# EAGLE design BirdHouseSchem (EAGLE 9.6.2)
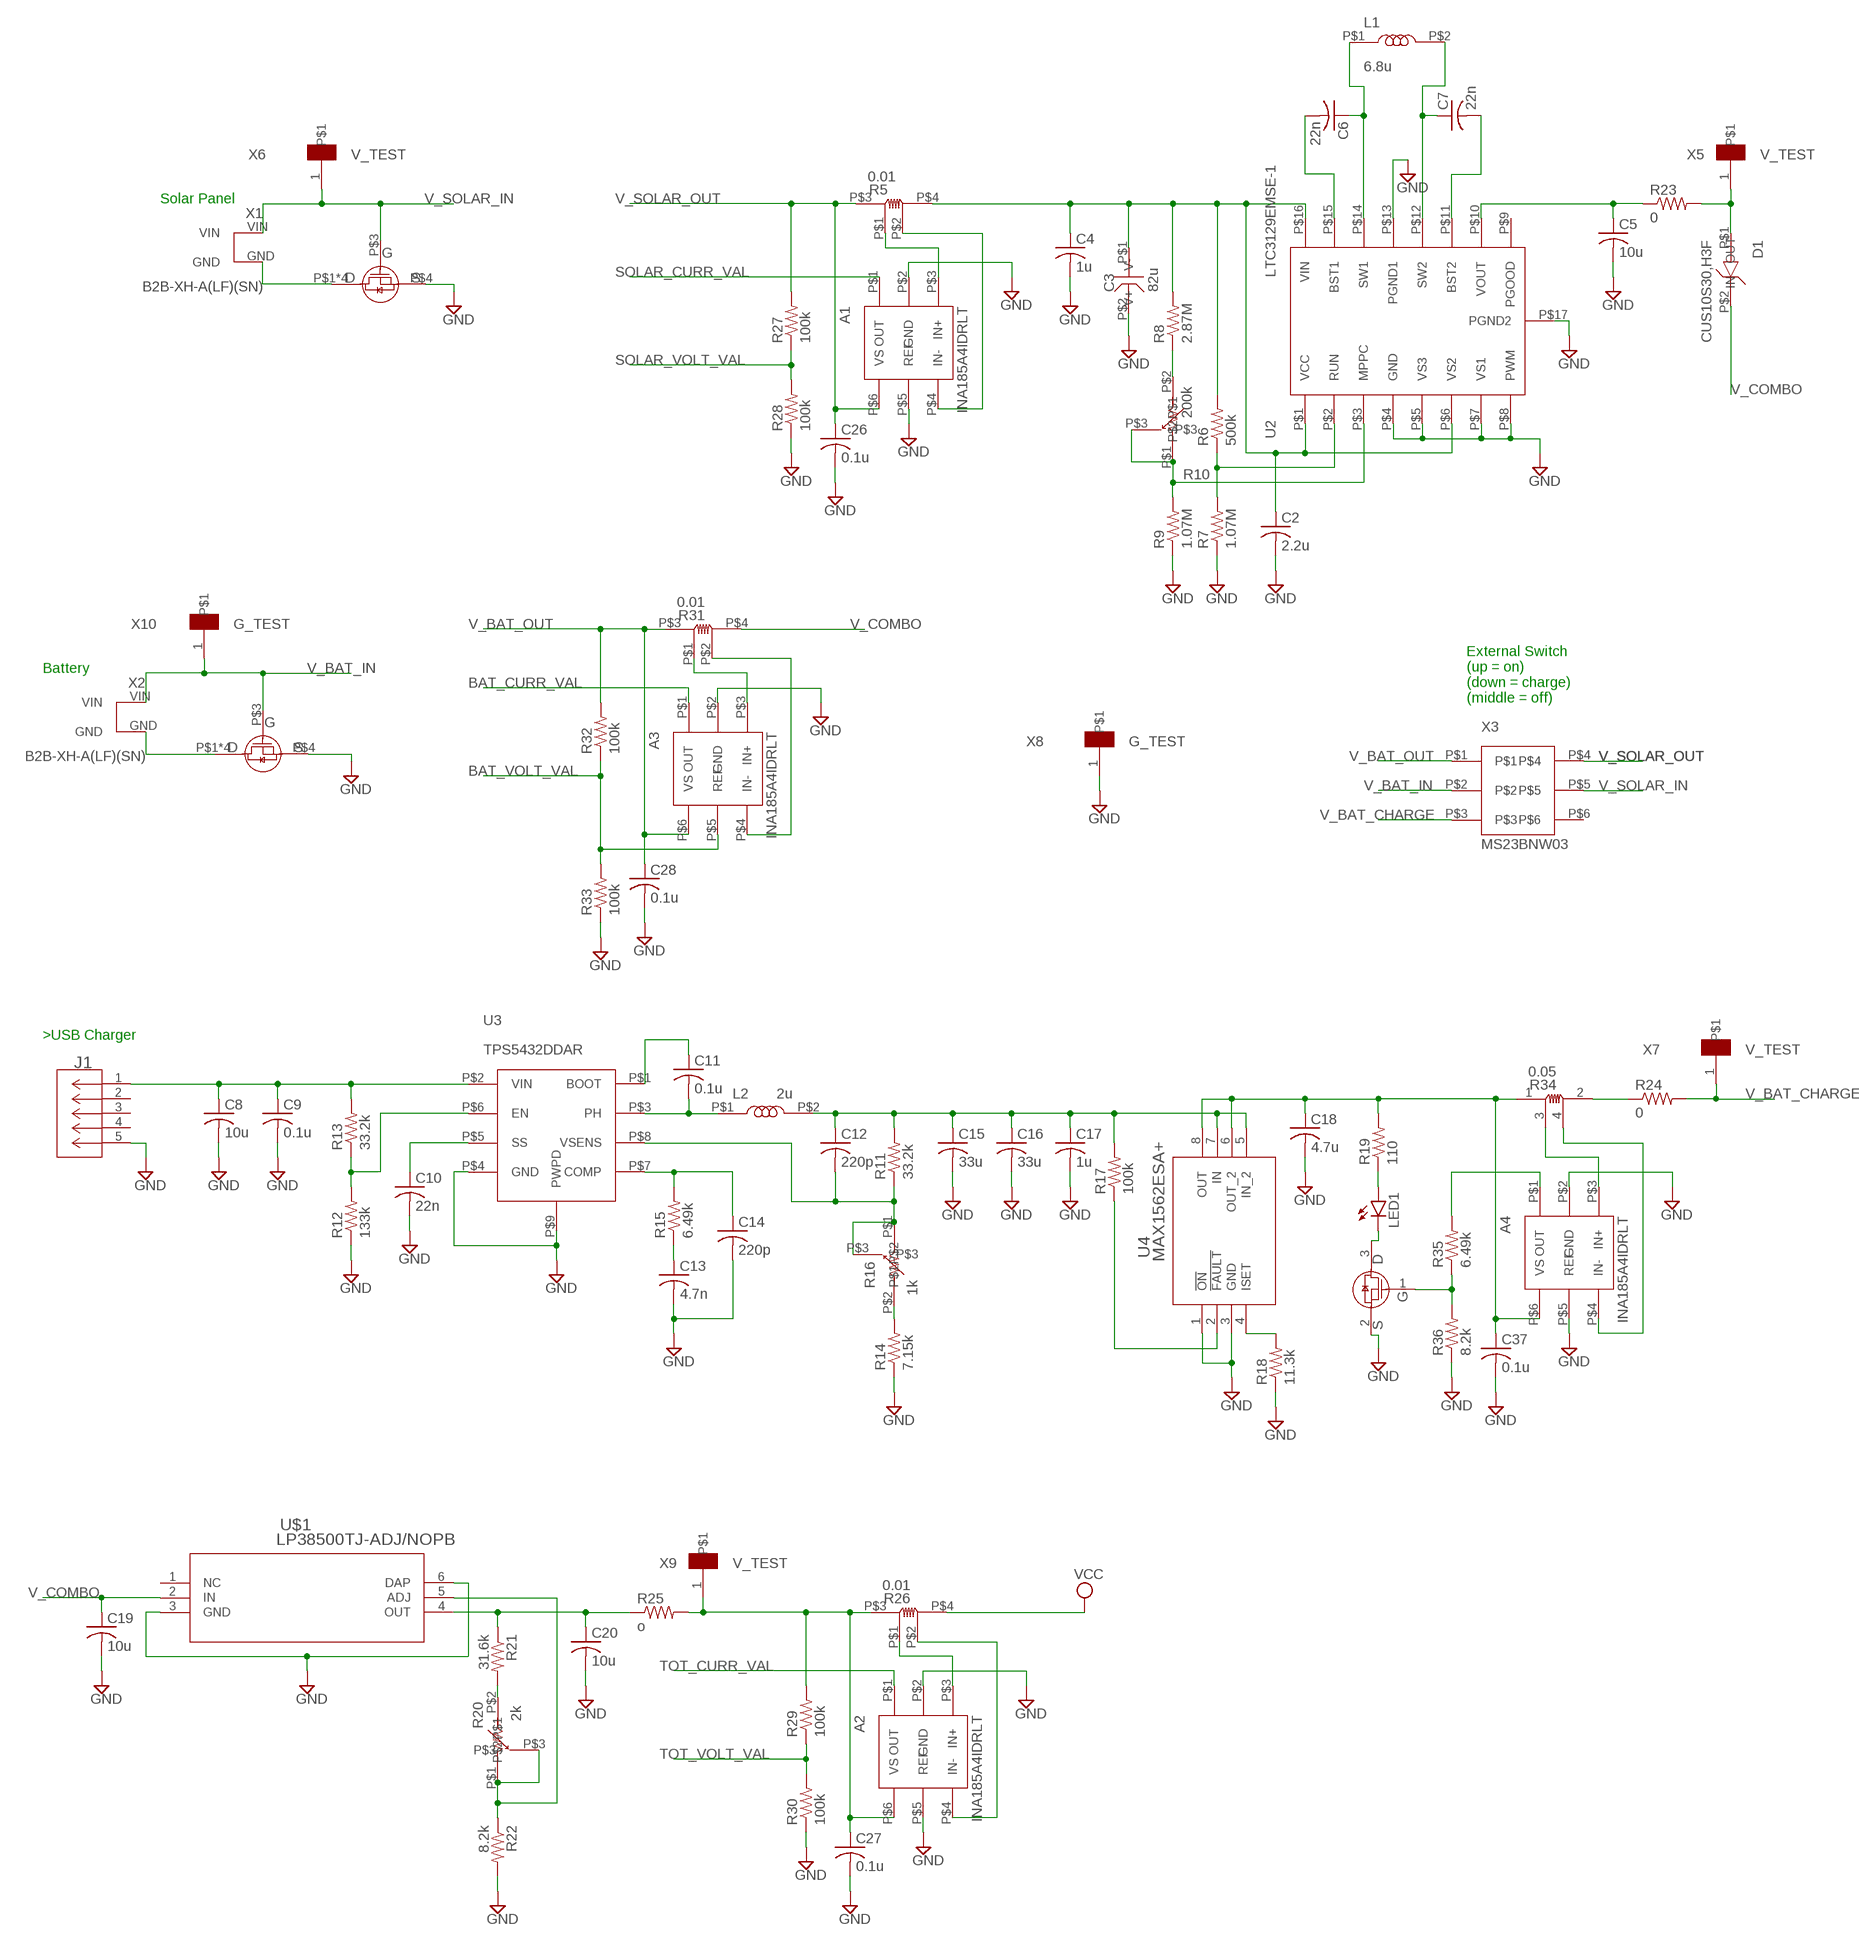
[diagram p0: schematic, sheet 1, part 1 of 2]
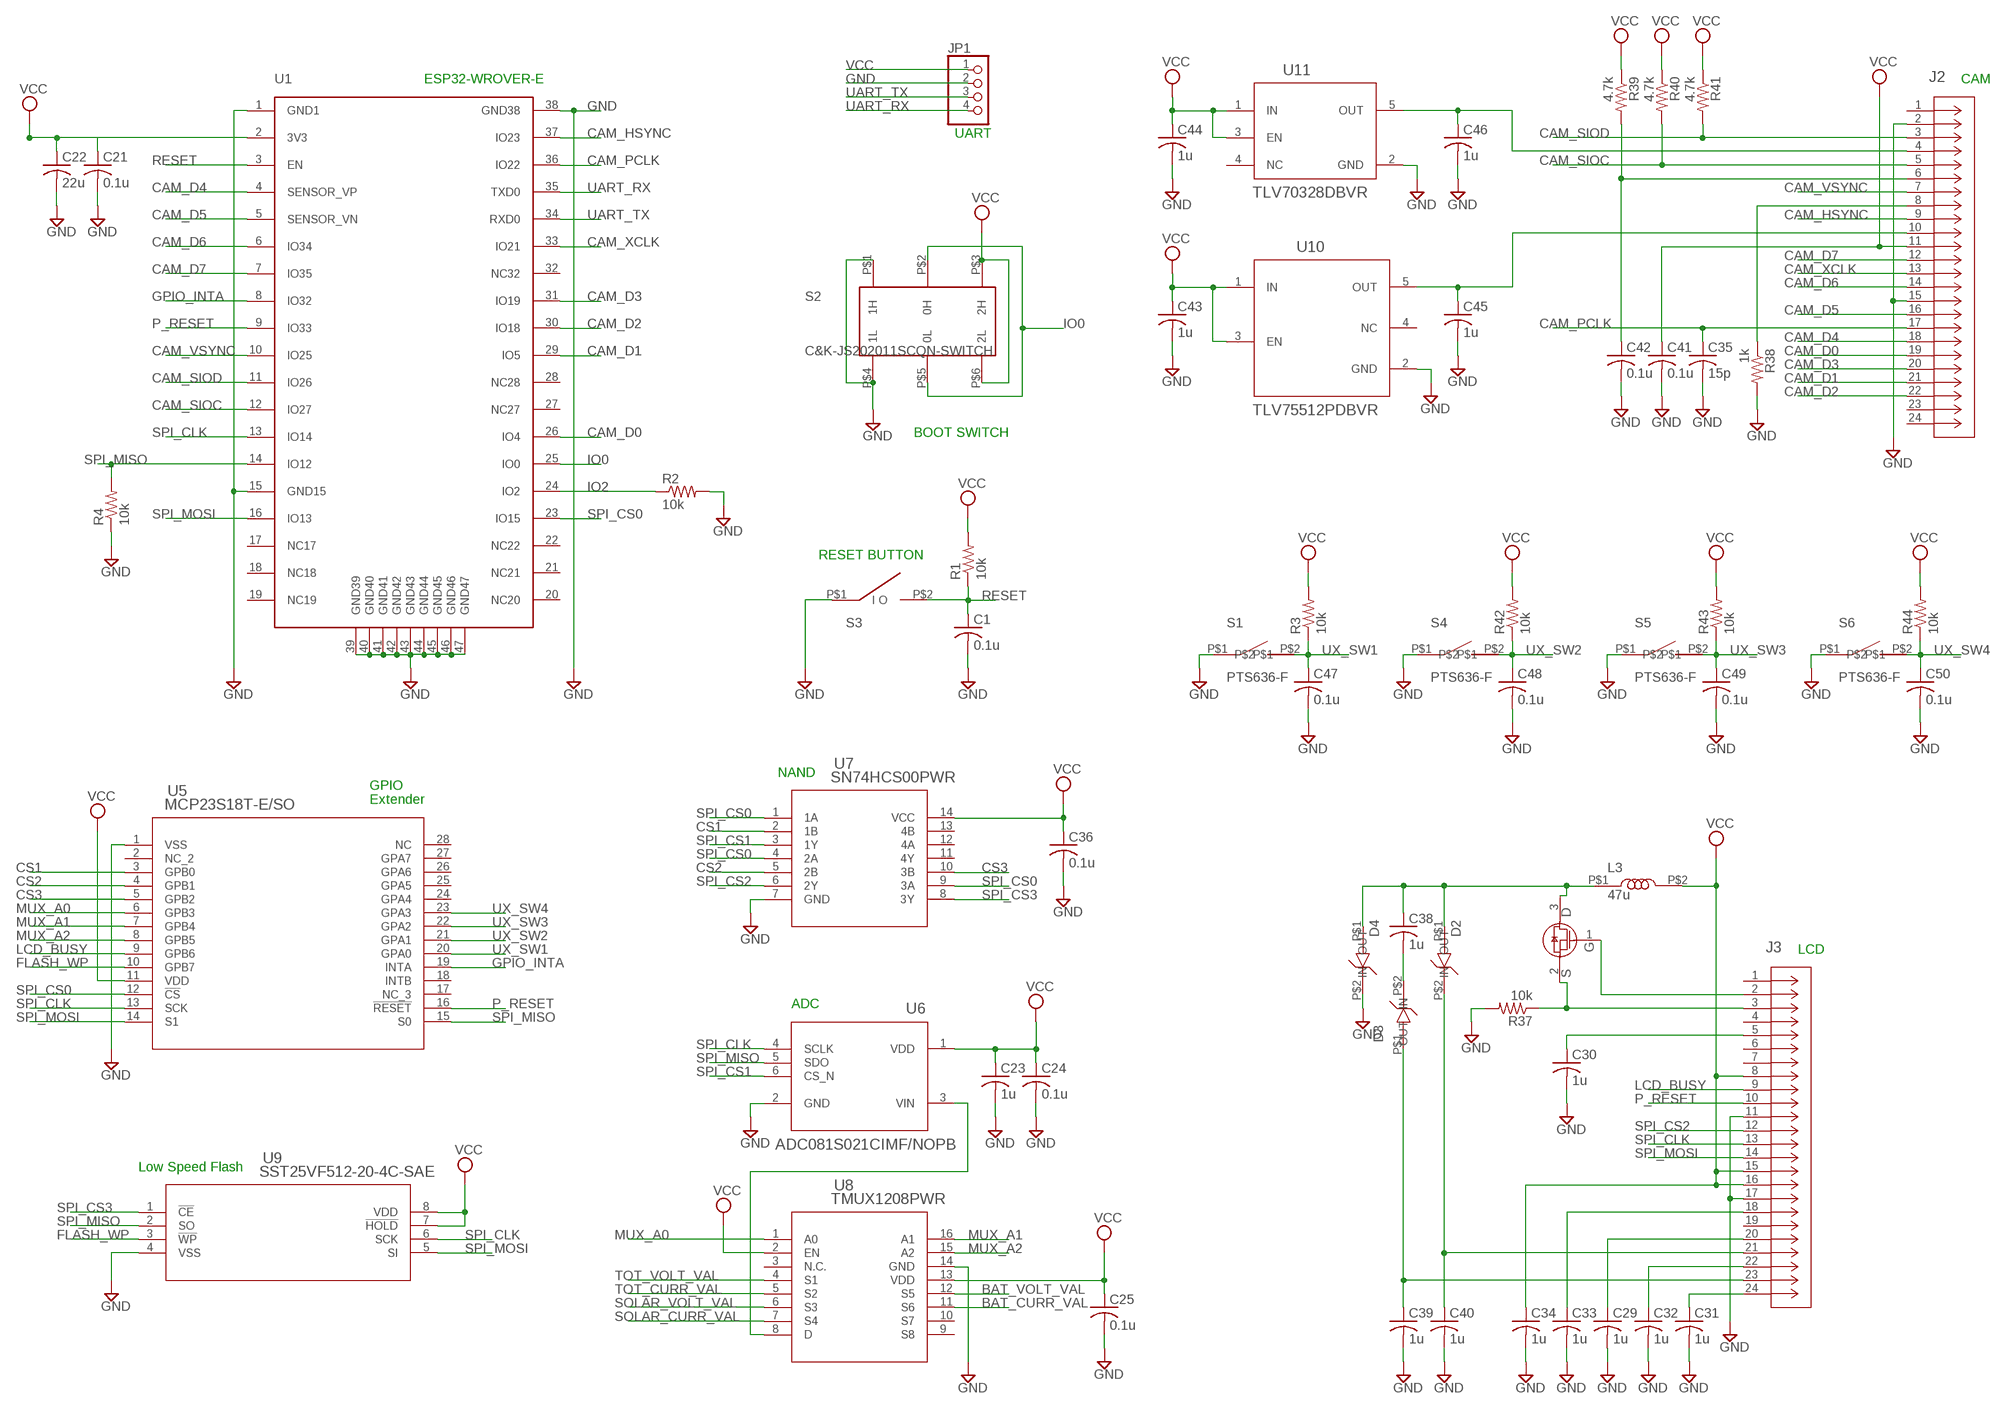
[diagram p1: schematic, sheet 1, part 2 of 2]

## Parts
A1  INA185A4IDRLT  [SOT-6]
A2  INA185A4IDRLT  [SOT-6]
A3  INA185A4IDRLT  [SOT-6]
A4  INA185A4IDRLT  [SOT-6]
C1  0.1u  C-USC0805  [C0805]
C2  2.2u  C-USC0805  [C0805]
C3  82u  EEE-FN1V820UP  [EEE-FN1V820UP]
C4  1u  C-USC0805  [C0805]
C5  10u  C-USC0805  [C0805]
C6  22n  C-USC0805  [C0805]
C7  22n  C-USC0805  [C0805]
C8  10u  C-USC0805  [C0805]
C9  0.1u  C-USC0805  [C0805]
C10  22n  C-USC0805  [C0805]
C11  0.1u  C-USC0805  [C0805]
C12  220p  C-USC0805  [C0805]
C13  4.7n  C-USC0805  [C0805]
C14  220p  C-USC0805  [C0805]
C15  33u  C-USC0805  [C0805]
C16  33u  C-USC0805  [C0805]
C17  1u  C-USC0805  [C0805]
C18  4.7u  C-USC0805  [C0805]
C19  10u  C-USC0805  [C0805]
C20  10u  C-USC0805  [C0805]
C21  0.1u  C-USC0805  [C0805]
C22  22u  C-USC0805  [C0805]
C23  1u  C-USC0805  [C0805]
C24  0.1u  C-USC0805  [C0805]
C25  0.1u  C-USC0805  [C0805]
C26  0.1u  C-USC0805  [C0805]
C27  0.1u  C-USC0805  [C0805]
C28  0.1u  C-USC0805  [C0805]
C29  1u  C-USC0805  [C0805]
C30  1u  C-USC0805  [C0805]
C31  1u  C-USC0805  [C0805]
C32  1u  C-USC0805  [C0805]
C33  1u  C-USC0805  [C0805]
C34  1u  C-USC0805  [C0805]
C35  15p  C-USC0603  [C0603]
C36  0.1u  C-USC0805  [C0805]
C37  0.1u  C-USC0805  [C0805]
C38  1u  C-USC0805  [C0805]
C39  1u  C-USC0805  [C0805]
C40  1u  C-USC0805  [C0805]
C41  0.1u  C-USC0805  [C0805]
C42  0.1u  C-USC0805  [C0805]
C43  1u  C-USC0805  [C0805]
C44  1u  C-USC0805  [C0805]
C45  1u  C-USC0805  [C0805]
C46  1u  C-USC0805  [C0805]
C47  0.1u  C-USC0805  [C0805]
C48  0.1u  C-USC0805  [C0805]
C49  0.1u  C-USC0805  [C0805]
C50  0.1u  C-USC0805  [C0805]
D1  CUS10S30,H3F  [CUS10S30,H3F]
D2  CUS10S30,H3F  [CUS10S30,H3F]
D3  CUS10S30,H3F  [CUS10S30,H3F]
D4  CUS10S30,H3F  [CUS10S30,H3F]
J1  10103594-0001LF  [CONN_10103594-0001LF_AMP]
J2  FH40-24S-0.5SV  [CONN_FH40-24S-0.5SV_HIR]
J3  FH40-24S-0.5SV  [CONN_FH40-24S-0.5SV_HIR]
JP1  PINHD-1X4  [1X04]
L1  6.8u  NRS8030T6R8MJGJ  [NRS8030T6R8MJGJ]
L2  2u  IHLP4040DZER2R0M11  [IHLP4040DZER2R0M11]
L3  47u  NRS8030T6R8MJGJ  [NRS8030T6R8MJGJ]
LED1  LEDCHIP-LED0805  [CHIP-LED0805]
R1  10k  R-US_R0805  [R0805]
R2  10k  R-US_R0805  [R0805]
R3  10k  R-US_R0805  [R0805]
R4  10k  R-US_R0805  [R0805]
R5  0.01  RL1632T4F-R005-FNH  [RL1632T4F-R005-FNH]
R6  500k  R-US_R0805  [R0805]
R7  1.07M  R-US_R0805  [R0805]
R8  2.87M  R-US_R0805  [R0805]
R9  1.07M  R-US_R0805  [R0805]
R10  200k  3361P-1-202GLF  [BOURNS-3361]
R11  33.2k  R-US_R0603  [R0603]
R12  133k  R-US_R0805  [R0805]
R13  33.2k  R-US_R0603  [R0603]
R14  7.15k  R-US_R0805  [R0805]
R15  6.49k  R-US_R0805  [R0805]
R16  1k  3361P-1-202GLF  [BOURNS-3361]
R17  100k  R-US_R0805  [R0805]
R18  11.3k  R-US_R0805  [R0805]
R19  110  R-US_R0805  [R0805]
R20  2k  3361P-1-202GLF  [BOURNS-3361]
R21  31.6k  R-US_R0805  [R0805]
R22  8.2k  R-US_R0805  [R0805]
R23  0  R-US_R0805  [R0805]
R24  0  R-US_R0805  [R0805]
R25  o  R-US_R0805  [R0805]
R26  0.01  RL1632T4F-R005-FNH  [RL1632T4F-R005-FNH]
R27  100k  R-US_R0805  [R0805]
R28  100k  R-US_R0805  [R0805]
R29  100k  R-US_R0805  [R0805]
R30  100k  R-US_R0805  [R0805]
R31  0.01  RL1632T4F-R005-FNH  [RL1632T4F-R005-FNH]
R32  100k  R-US_R0805  [R0805]
R33  100k  R-US_R0805  [R0805]
R34  0.05  RL0816T4F-4  [RL0816T4F-4]
R35  6.49k  R-US_R0805  [R0805]
R36  8.2k  R-US_R0805  [R0805]
R37  10k  R-US_R0805  [R0805]
R38  1k  R-US_R0805  [R0805]
R39  4.7k  R-US_R0805  [R0805]
R40  4.7k  R-US_R0805  [R0805]
R41  4.7k  R-US_R0805  [R0805]
R42  10k  R-US_R0805  [R0805]
R43  10k  R-US_R0805  [R0805]
R44  10k  R-US_R0805  [R0805]
S1  PTS636-F  [PTS636-F]
S2  C&K-JS202011SCQN-SWITCH  [C&K-JS202011SCQN-SWITCH]
S3  C&K-PTS636SL43SMTRLFS-PUSHBUTTON  [C&K-PTS636SL43SMTRLFS-PUSHBUTTON]
S4  PTS636-F  [PTS636-F]
S5  PTS636-F  [PTS636-F]
S6  PTS636-F  [PTS636-F]
TR1  SI3464DV-T1-BE3  [TSOP-6]
TR2  SI3464DV-T1-BE3  [TSOP-6]
TR3  NX6008NBKW  [SOT323]
TR4  PMF250XNEX  [SOT323]
U1  ESP32-WROVER-E  [ESP32-WROVER-E]
U2  LTC3129EMSE-1  [LTC3129EMSE-1]
U3  TPS5432DDAR  [TPS5432DDAR]
U4  MAX1562ESA+  [21-0041_S8+2_MXM]
U5  MCP23S18T-E/SO  [SOIC28-W_MC_MCH]
U6  ADC081S021CIMF/NOPB  [DBV0006A_N]
U7  SN74HCS00PWR  [TSSOP14_PW_TEX]
U8  TMUX1208PWR  [PW_16_TEX]
U9  SST25VF512-20-4C-SAE  [SOIC8_SA_SST_MCH]
U10  TLV75512PDBVR  [DBV0005A_N]
U11  TLV70328DBVR  [DBV0005A-IPC_A]
U$1  LP38500TJ-ADJ/NOPB  [TJ5A]
X1  B2B-XH-A(LF)(SN)  [B2B-XH-A(LF)(SN)]
X2  B2B-XH-A(LF)(SN)  [B2B-XH-A(LF)(SN)]
X3  MS23BNW03  [MS23BNW03]
X5  V_TEST  [V_TEST]
X6  V_TEST  [V_TEST]
X7  V_TEST  [V_TEST]
X8  G_TEST  V_TEST  [V_TEST]
X9  V_TEST  [V_TEST]
X10  G_TEST  V_TEST  [V_TEST]

## Nets
BAT_CURR_VAL: A3.P$1(OUT) U8.11(S6)
BAT_VOLT_VAL: A3.P$5(REF) R32.1 R33.2 U8.12(S5)
CAM_D0: J2.19 U1.26(IO4)
CAM_D1: J2.21 U1.29(IO5)
CAM_D2: J2.22 U1.30(IO18)
CAM_D3: J2.20 U1.31(IO19)
CAM_D4: J2.18 U1.4(SENSOR_VP)
CAM_D5: J2.16 U1.5(SENSOR_VN)
CAM_D6: J2.14 U1.6(IO34)
CAM_D7: J2.12 U1.7(IO35)
CAM_HSYNC: J2.9 U1.37(IO23)
CAM_PCLK: C35.1 J2.17 U1.36(IO22)
CAM_SIOC: J2.5 R40.2 U1.12(IO27)
CAM_SIOD: J2.3 R41.2 U1.11(IO26)
CAM_VSYNC: J2.7 U1.10(IO25)
CAM_XCLK: J2.13 U1.33(IO21)
CS1: U5.3(GPB0) U7.2(1B)
CS2: U5.4(GPB1) U7.5(2B)
CS3: U5.5(GPB2) U7.10(3B)
FLASH_WP: U5.10(GPB7) U9.3(!WP)
GND: A1.P$2(GND) A1.P$5(REF) A2.P$2(GND) A2.P$5(REF) A3.P$2(GND) A4.P$2(GND) A4.P$5(REF) C1.2 C2.2 C3.P$2(V-) C4.2 C5.2 C8.2 C9.2 C10.2 C13.2 C14.2 C15.2 C16.2 C17.2 C18.2 C19.2 C20.2 C21.2 C22.2 C23.2 C24.2 C25.2 C26.2 C27.2 C28.2 C29.2 C30.2 C31.2 C32.2 C33.2 C34.2 C35.2 C36.2 C37.2 C39.2 C40.2 C41.2 C42.2 C43.2 C44.2 C45.2 C46.2 C47.2 C48.2 C49.2 C50.2 D4.P$2(OUT) J1.5 J2.2 J2.15 J3.11 J3.17 JP1.2 R2.2 R4.1 R7.1 R9.1 R12.1 R14.1 R18.1 R22.2 R28.1 R30.1 R33.1 R36.1 R37.2 R38.2 S1.P$1 S2.P$1(1H) S2.P$4(1L) S3.P$1(I) S4.P$1 S5.P$1 S6.P$1 TR1.P$4(S) TR2.P$4(S) TR3.2(S) U1.1(GND1) U1.15(GND15) U1.38(GND38) U1.39(GND39) U1.40(GND40) U1.41(GND41) U1.42(GND42) U1.43(GND43) U1.44(GND44) U1.45(GND45) U1.46(GND46) U1.47(GND47) U2.P$4(GND) U2.P$5(VS3) U2.P$7(VS1) U2.P$8(PWM) U2.P$13(PGND1) U2.P$17(PGND2) U3.P$4(GND) U3.P$9(PWPD) U4.1(!ON) U4.3(GND) U5.1(VSS) U6.2(GND) U7.7(GND) U8.14(GND) U9.4(VSS) U10.2(GND) U11.2(GND) U$1.3(GND) U$1.6(DAP) X8.1
GPIO_INTA: U1.8(IO32) U5.19(INTA)
IO0: S2.P$2(0H) S2.P$5(0L) U1.25(IO0)
IO2: R2.1 U1.24(IO2)
LCD_BUSY: J3.9 U5.9(GPB6)
MUX_A0: U5.6(GPB3) U8.1(A0)
MUX_A1: U5.7(GPB4) U8.16(A1)
MUX_A2: U5.8(GPB5) U8.15(A2)
N$1: A3.P$4(IN-) R31.P$2(V2)
N$2: TR1.P$1(D) TR1.P$2(D) TR1.P$5(D) TR1.P$6(D) X1.GND
N$3: C2.1 C3.P$1(V+) C4.1 R5.P$4(I2) R6.2 R8.2 U2.P$1(VCC) U2.P$6(VS2) U2.P$16(VIN)
N$4: A1.P$3(IN+) R5.P$1(V1)
N$5: A1.P$4(IN-) R5.P$2(V2)
N$6: TR2.P$1(D) TR2.P$2(D) TR2.P$5(D) TR2.P$6(D) X2.GND
N$7: R6.1 R7.2 U2.P$2(RUN)
N$8: R9.2 R10.P$1 R10.P$3 U2.P$3(MPPC)
N$9: C6.1 L1.P$1 U2.P$14(SW1)
N$10: C5.1 R23.1 U2.P$10(VOUT)
N$11: C6.2 U2.P$15(BST1)
N$12: C7.1 L1.P$2 U2.P$12(SW2)
N$13: C7.2 U2.P$11(BST2)
N$14: C8.1 C9.1 J1.1 R13.2 U3.P$2(VIN)
N$15: R8.1 R10.P$2
N$16: R12.2 R13.1 U3.P$6(EN)
N$17: C10.1 U3.P$5(SS)
N$18: C12.2 R11.1 R16.P$1 R16.P$3 U3.P$8(VSENS)
N$19: C14.1 R15.2 U3.P$7(COMP)
N$20: C13.1 R15.1
N$21: R14.2 R16.P$2
N$22: C11.2 L2.P$1 U3.P$3(PH)
N$23: C11.1 U3.P$1(BOOT)
N$24: C12.1 C15.1 C16.1 C17.1 L2.P$2 R11.2 R17.2 U4.5(IN_2) U4.7(IN)
N$25: LED1.A R19.1
N$26: R17.1 U4.2(!FAULT)
N$27: R18.2 U4.4(ISET)
N$28: R20.P$1 R20.P$3 R22.1 U$1.5(ADJ)
N$29: R20.P$2 R21.2
N$30: C20.1 R21.1 R25.1 U$1.4(OUT)
N$31: D1.P$1(IN) R23.2 X5.1
N$32: A3.P$3(IN+) R31.P$1(V1)
N$33: A2.P$3(IN+) R26.P$1(V1)
N$34: A2.P$4(IN-) R26.P$2(V2)
N$35: A2.P$6(VS) C27.1 R25.2 R26.P$3(I1) R29.2 X9.1
N$36: U6.3(VIN) U8.8(D)
N$37: C33.1 J3.18
N$38: C30.1 J3.5
N$39: C29.1 J3.20
N$40: C31.1 J3.24
N$41: C32.1 J3.22
N$42: A4.P$3(IN+) R34.3(V1)
N$43: A4.P$4(IN-) R34.4(V2)
N$44: R24.1 R34.2(I2)
N$45: A4.P$1(OUT) R35.2
N$46: R35.1 R36.2 TR3.1(G)
N$47: LED1.C TR3.3(D)
N$48: J3.2 TR4.1(G)
N$49: J3.3 R37.1 TR4.2(S)
N$50: J2.8 R38.1
N$51: C40.1 D2.P$2(OUT) J3.21
N$52: C38.1 D2.P$1(IN) D4.P$1(IN) L3.P$1 TR4.3(D)
N$53: C38.2 D3.P$2(OUT)
N$54: C39.1 D3.P$1(IN) J3.23
N$55: C42.1 J2.6 R39.2
N$56: C46.1 J2.4 U11.5(OUT)
N$57: C45.1 J2.10 U10.5(OUT)
N$65: A4.P$6(VS) C18.1 C37.1 R19.2 R34.1(I1) U4.6(OUT_2) U4.8(OUT)
P_RESET: J3.10 U1.9(IO33) U5.16(!RESET)
RESET: C1.1 R1.1 S3.P$2(O) U1.3(EN)
SOLAR_CURR_VAL: A1.P$1(OUT) U8.7(S4)
SOLAR_VOLT_VAL: R27.1 R28.2 U8.6(S3)
SPI_CLK: J3.13 U1.13(IO14) U5.13(SCK) U6.4(SCLK) U9.6(SCK)
SPI_CS0: U1.23(IO15) U5.12(!CS) U7.1(1A) U7.4(2A) U7.9(3A)
SPI_CS1: U6.6(CS_N) U7.3(1Y)
SPI_CS2: J3.12 U7.6(2Y)
SPI_CS3: U7.8(3Y) U9.1(!CE)
SPI_MISO: R4.2 U1.14(IO12) U5.15(S0) U6.5(SDO) U9.2(SO)
SPI_MOSI: J3.14 U1.16(IO13) U5.14(S1) U9.5(SI)
TOT_CURR_VAL: A2.P$1(OUT) U8.5(S2)
TOT_VOLT_VAL: R29.1 R30.2 U8.4(S1)
UART_RX: JP1.4 U1.35(TXD0)
UART_TX: JP1.3 U1.34(RXD0)
UX_SW1: C47.1 R3.1 S1.P$2 U5.20(GPA0)
UX_SW2: C48.1 R42.1 S4.P$2 U5.21(GPA1)
UX_SW3: C49.1 R43.1 S5.P$2 U5.22(GPA2)
UX_SW4: C50.1 R44.1 S6.P$2 U5.23(GPA3)
V_BAT_CHARGE: R24.2 X3.P$3 X7.1
V_BAT_IN: TR2.P$3(G) X2.VIN X3.P$2 X10.1
V_BAT_OUT: A3.P$6(VS) C28.1 R31.P$3(I1) R32.2 X3.P$1
V_COMBO: C19.1 D1.P$2(OUT) R31.P$4(I2) U$1.2(IN)
V_SOLAR_IN: TR1.P$3(G) X1.VIN X3.P$5 X6.1
V_SOLAR_OUT: A1.P$6(VS) C26.1 R5.P$3(I1) R27.2 X3.P$4
VCC: C21.1 C22.1 C23.1 C24.1 C25.1 C34.1 C36.1 C41.1 C43.1 C44.1 J2.11 J3.8 J3.15 J3.16 JP1.1 L3.P$2 R1.2 R3.2 R26.P$4(I2) R39.1 R40.1 R41.1 R42.2 R43.2 R44.2 S2.P$3(2H) S2.P$6(2L) U1.2(3V3) U5.11(VDD) U6.1(VDD) U7.14(VCC) U8.2(EN) U8.13(VDD) U9.7(!HOLD) U9.8(VDD) U10.1(IN) U10.3(EN) U11.1(IN) U11.3(EN)
Unconnected: J1.2 J1.3 J1.4 J2.1 J2.23 J2.24 J3.1 J3.4 J3.6 J3.7 J3.19 U1.17(NC17) U1.18(NC18) U1.19(NC19) U1.20(NC20) U1.21(NC21) U1.22(NC22) U1.27(NC27) U1.28(NC28) U1.32(NC32) U2.P$9(PGOOD) U5.2(NC_2) U5.17(NC_3) U5.18(INTB) U5.24(GPA4) U5.25(GPA5) U5.26(GPA6) U5.27(GPA7) U5.28(NC) U7.11(4Y) U7.12(4A) U7.13(4B) U8.3(N.C.) U8.9(S8) U8.10(S7) U10.4(NC) U11.4(NC) U$1.1(NC) X3.P$6

## Notes on the sheet
- Solar Panel
- ESP32-WROVER-E | CAM
- UART
- Battery | BOOT SWITCH
- External Switch
  (up = on)
  (down = charge)
  (middle = off)
- RESET BUTTON
- >USB Charger | NAND
- GPIO
  Extender
- LCD
- ADC
- Low Speed Flash

## Library data of the parts
A1-A4 = Birdhouse:INA185A4IDRLT
C1 C2 C4-C50 = rcl:C-US: CAPACITOR, American symbol; SPICEPREFIX: C
C3 = Birdhouse:EEE-FN1V820UP
D1-D4 = Birdhouse:CUS10S30,H3F
J1 = Birdhouse:10103594-0001LF; COPYRIGHT: Copyright (C) 2023 Ultra Librarian. All rights reserved.; DIGI-KEY_PART_NUMBER_1: 609-4050-2-ND; DIGI-KEY_PART_NUMBER_2: 609-4050-1-ND; DIGI-KEY_PART_NUMBER_3: 609-4050-6-ND; DIGI-KEY_PART_NUMBER_4: 609-4050-2-NDL; MANUFACTURER_PART_NUMBER: 10103594-0001LF; MFR_NAME: Amphenol ICC
J2 J3 = Birdhouse:FH40-24S-0.5SV; COPYRIGHT: Copyright (C) 2023 Ultra Librarian. All rights reserved.; DIGI-KEY_PART_NUMBER_1: HFW24TR-ND; DIGI-KEY_PART_NUMBER_2: HFW24CT-ND; DIGI-KEY_PART_NUMBER_3: HFW24DKR-ND; MANUFACTURER_PART_NUMBER: FH40-24S-0.5SV; MFR_NAME: Hirose
JP1 = pinhead:PINHD-1X4: PIN HEADER
L1 L3 = Birdhouse:NRS8030T6R8MJGJ
L2 = Birdhouse:IHLP4040DZER2R0M11
LED1 = led:LED: LED OSRAM: - CHIPLED LG R971, LG N971, LY N971, LG Q971, LY Q971, LO R971, LY R971 LH N974, LH R974 LS Q976, LO Q976, LY Q976 LO Q996 - Hyper CHIPLED LW Q18S LB Q993, LB Q99A, LB R99A - SideLED LS A670, LO A670, LY A670, LG A670, LP A670 LB A673, LV A673, LT A673, LW A673 LH A674 LY A675 LS A676, LA A676, LO A676, LY A676, LW A676 LS A679, LY A679, LG A679 - Hyper Micro SIDELED® LS Y876, LA Y876, LO Y876, LY Y876 LT Y87S - SmartLED LW L88C, LW L88S LB L89C, LB L89S, LG L890 LS L89K, LO L89K, LY L89K LS L896, LA L896, LO L896, LY L896 - TOPLED LS T670, LO T670, LY T670, LG T670, LP T670 LSG T670, LSP T670, LSY T670, LOP T670, LYG T670 LG T671, LOG T671, LSG T671 LB T673, LV T673, LT T673, LW T673 LH T674 LS T676, LA T676, LO T676, LY T676, LB T676, LH T676, LSB T676, LW T676 LB T67C, LV T67C, LT T67C, LS T67K, LO T67K, LY T67K, LW E67C LS E67B, LA E67B, LO E67B, LY E67B, LB E67C, LV E67C, LT E67C LW T67C LS T679, LY T679, LG T679 LS T770, LO T770, LY T770, LG T770, LP T770 LB T773, LV T773, LT T773, LW T773 LH T774 LS E675, LA E675, LY E675, LS T675 LS T776, LA T776, LO T776, LY T776, LB T776 LHGB T686 LT T68C, LB T68C - Hyper Mini TOPLED® LB M676 - Mini TOPLED Santana® LG M470 LS M47K, LO M47K, LY M47K Source: http://www.osram.convergy.de LUXEON: - LUMILED® LXK2-PW12-R00, LXK2-PW12-S00, LXK2-PW14-U00, LXK2-PW14-V00 LXK2-PM12-R00, LXK2-PM12-S00, LXK2-PM14-U00 LXK2-PE12-Q00, LXK2-PE12-R00, LXK2-PE12-S00, LXK2-PE14-T00, LXK2-PE14-U00 LXK2-PB12-K00, LXK2-PB12-L00, LXK2-PB12-M00, LXK2-PB14-N00, LXK2-PB14-P00, LXK2-PB14-Q00 LXK2-PR12-L00, LXK2-PR12-M00, LXK2-PR14-Q00, LXK2-PR14-R00 LXK2-PD12-Q00, LXK2-PD12-R00, LXK2-PD12-S00 LXK2-PH12-R00, LXK2-PH12-S00 LXK2-PL12-P00, LXK2-PL12-Q00, LXK2-PL12-R00 Source: www.luxeon.com KINGBRIGHT: KA-3528ASYC Source: www.kingbright.com
R1-R4 R6-R9 R11-R15 R17-R19 R21-R25 R27-R30 R32 R33 R35-R44 = rcl:R-US_: RESISTOR, American symbol; SPICEPREFIX: R
R5 R26 R31 = Birdhouse:RL1632T4F-R005-FNH
R10 R16 R20 = Birdhouse:3361P-1-202GLF
R34 = Birdhouse:RL0816T4F-4
S1 S4-S6 = Birdhouse:PTS636-F
S2 = OddsBooster:C&K-JS202011SCQN-SWITCH
S3 = OddsBooster:C&K-PTS636SL43SMTRLFS-PUSHBUTTON
TR1 TR2 = Birdhouse:SI3464DV-T1-BE3
TR3 = Birdhouse:NX6008NBKW
TR4 = Birdhouse:PMF250XNEX
U1 = OddsBooster:ESP32-WROVER-E: ESP32-WROVER-E Module used for Bluetooth and Wifi commmunications. Includes Transceiver IC, MCU, Antenna, and Xtal Oscillators.
U2 = Birdhouse:LTC3129EMSE-1
U3 = Birdhouse:TPS5432DDAR
U4 = Birdhouse:MAX1562ESA+; COPYRIGHT: Copyright (C) 2023 Ultra Librarian. All rights reserved.; MANUFACTURER_PART_NUMBER: MAX1562ESA+; MFR_NAME: Analog Devices Inc
U5 = Birdhouse:MCP23S18T-E/SO; COPYRIGHT: Copyright (C) 2023 Ultra Librarian. All rights reserved.; DIGI-KEY_PART_NUMBER_1: MCP23S18T-E/SO-ND; DIGI-KEY_PART_NUMBER_2: MCP23S18T-E/SOCT-ND; DIGI-KEY_PART_NUMBER_3: MCP23S18T-E/SODKR-ND; DIGI-KEY_PART_NUMBER_4: MCP23S18T-E/SOTR-ND; MANUFACTURER_PART_NUMBER: MCP23S18T-E/SO; MFR_NAME: Microchip
U6 = Birdhouse:ADC081S021CIMF/NOPB; COPYRIGHT: Copyright (C) 2023 Ultra Librarian. All rights reserved.; DIGI-KEY_PART_NUMBER_1: 2156-ADC081S021CIMF/NOPB-ND; DIGI-KEY_PART_NUMBER_2: 2156-ADC081S021CIMF/NOPB-TI-ND; DIGI-KEY_PART_NUMBER_3: ADC081S021CIMF/NOPBCT-ND; DIGI-KEY_PART_NUMBER_4: ADC081S021CIMF/NOPBDKR-ND; DIGI-KEY_PART_NUMBER_5: ADC081S021CIMF/NOPBTR-ND; MANUFACTURER_PART_NUMBER: ADC081S021CIMF/NOPB; MFR_NAME: Texas Instruments
U7 = Birdhouse:SN74HCS00PWR; COPYRIGHT: Copyright (C) 2023 Ultra Librarian. All rights reserved.; MANUFACTURER_PART_NUMBER: SN74HCS00PWR; MFR_NAME: Texas Instruments
U8 = Birdhouse:TMUX1208PWR; COPYRIGHT: Copyright (C) 2023 Ultra Librarian. All rights reserved.; DIGI-KEY_PART_NUMBER_1: 296-51847-1-ND; DIGI-KEY_PART_NUMBER_2: 296-51847-2-ND; DIGI-KEY_PART_NUMBER_3: 296-51847-6-ND; MANUFACTURER_PART_NUMBER: TMUX1208PWR; MFR_NAME: Texas Instruments
U9 = Birdhouse:SST25VF512-20-4C-SAE; COPYRIGHT: Copyright (C) 2023 Ultra Librarian. All rights reserved.; MANUFACTURER_PART_NUMBER: SST25VF512-20-4C-SAE; MFR_NAME: Microchip
U10 = Birdhouse:TLV75512PDBVR; COPYRIGHT: Copyright (C) 2023 Ultra Librarian. All rights reserved.; MANUFACTURER_PART_NUMBER: TLV75512PDBVR; MFR_NAME: Texas Instruments; REFDES: RefDes; TYPE: TYPE
U11 = Birdhouse:TLV70328DBVR; COPYRIGHT: Copyright (C) 2023 Ultra Librarian. All rights reserved.; MANUFACTURER_PART_NUMBER: TLV70328DBVR; MFR_NAME: Texas Instruments; REFDES: RefDes; TYPE: TYPE
U$1 = Birdhouse:LP38500TJ-ADJ/NOPB; COPYRIGHT: Copyright (C) 2023 Ultra Librarian. All rights reserved.; DIGI-KEY_PART_NUMBER_1: LP38500TJ-ADJ/NOPBCT-ND; DIGI-KEY_PART_NUMBER_2: LP38500TJ-ADJ/NOPBDKR-ND; DIGI-KEY_PART_NUMBER_3: LP38500TJ-ADJ/NOPBTR-ND; DIGI-KEY_PART_NUMBER_4: 2156-LP38500TJ-ADJ/NOPB-ND; MANUFACTURER_PART_NUMBER: LP38500TJ-ADJ/NOPB; MFR_NAME: Texas Instruments
X1 X2 = Birdhouse:B2B-XH-A(LF)(SN)
X3 = Birdhouse:MS23BNW03
X5-X10 = Birdhouse:V_TEST

## Board
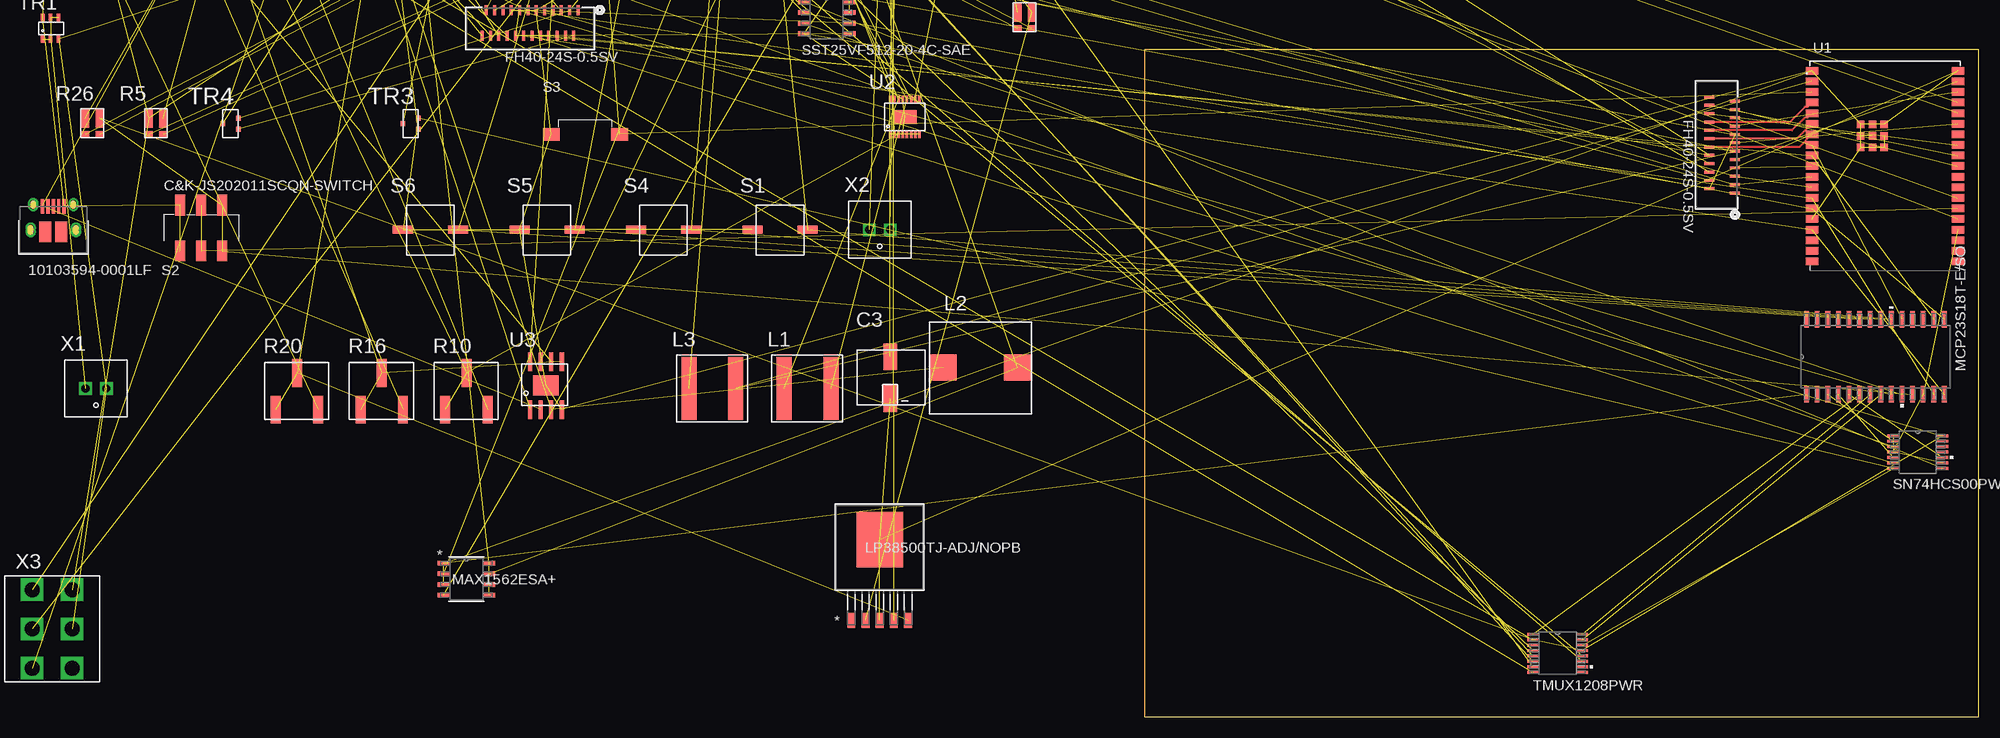
[diagram p2: board, top side]
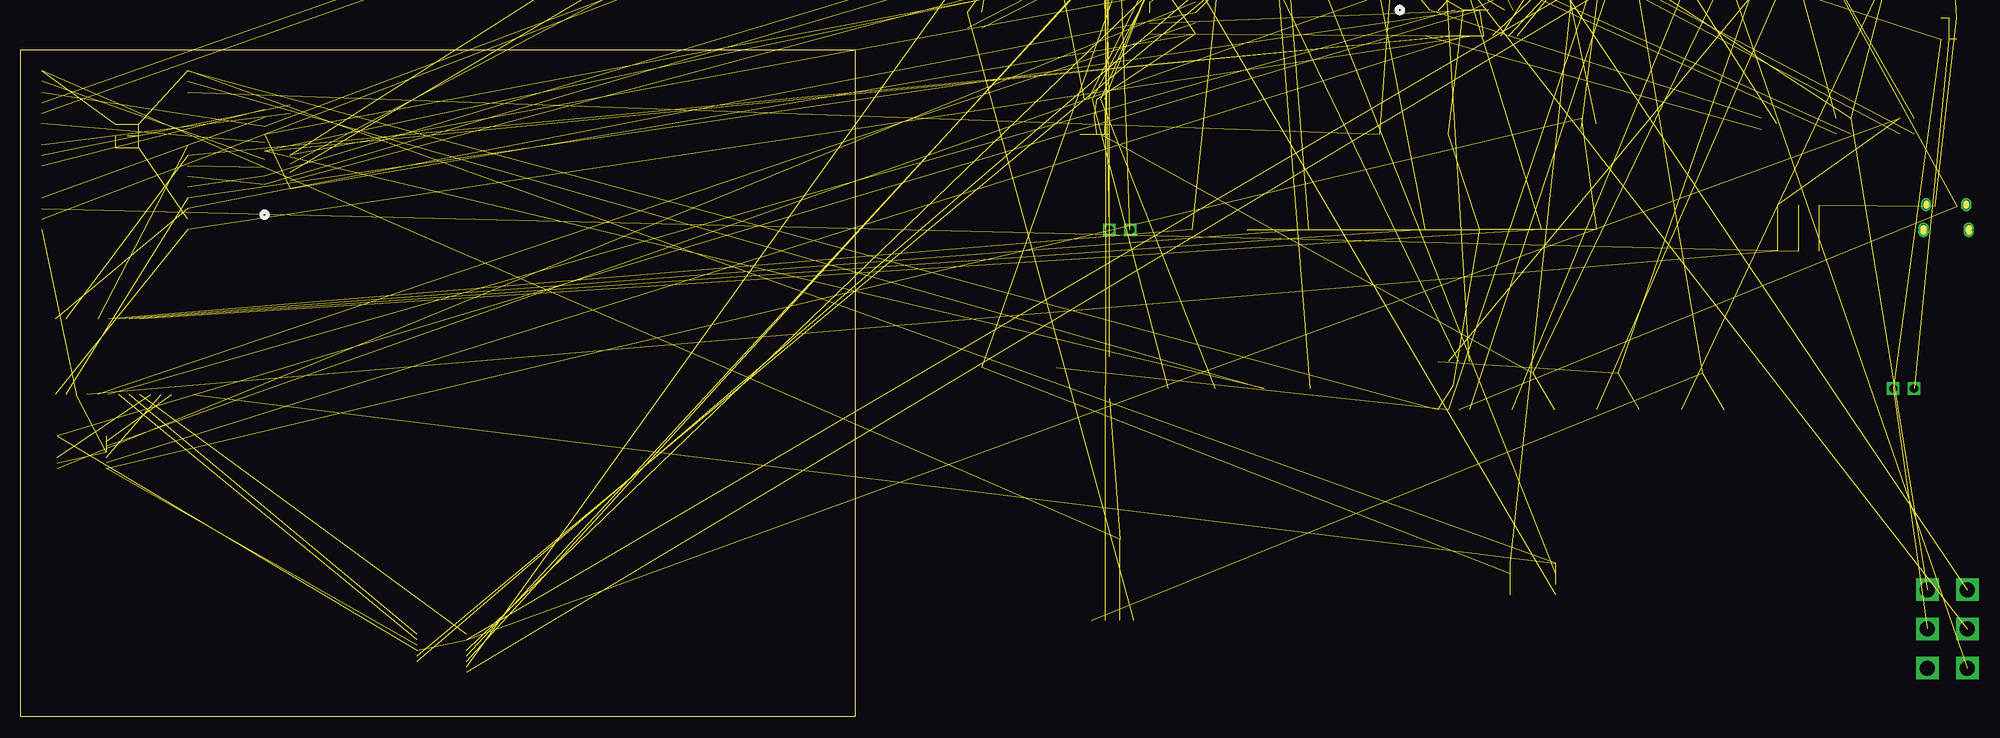
[diagram p3: board, bottom side, seen from below]

Size 233.53 x 80 mm. Coordinates in mm from the lower left corner, seen from the top.
Outline: 133.53,0 233.53,0 233.53,80 133.53,80 133.53,0
Copper layers (1*16): Top 0.035mm / dielectric 1.5mm / Bottom 0.035mm
Design rules "default": minimum track width 6mil, minimum drill 0.35mm, track to track 6mil, track to pad 6mil, pad to pad 6mil, via to via 6mil, smd to smd 6mil, copper to edge 40mil, drill to drill 6mil, minimum pad ring 10mil, minimum via ring 8mil, stop-mask expansion 4mil, vias tented up to drill 0mil, thermal gap 10mil

### Footprints (pad centres in the part's own frame; a part is rotated, then mirrored left to right if it is on the bottom)
SOT-6 = smd 0.67 x 0.3: P$1 0,0; P$2 0,-0.5; P$3 0,-1; P$4 1.48,-1; P$5 1.48,-0.5; P$6 1.48,0
C0805 = smd 1.3 x 1.5: 1 -0.95,0; 2 0.95,0
EEE-FN1V820UP = smd 1.6 x 3.2: P$1 0,0; P$2 0,-5
C0603 = smd 1.1 x 1: 1 -0.85,0; 2 0.85,0
CUS10S30,H3F = smd 0.8 x 0.9: P$1 0,0; P$2 2.3,0
CONN_10103594-0001LF_AMP = smd 0.406 x 1.753: 1 -1.3,2.807; 2 -0.65,2.807; 3 0,2.807; 4 0.65,2.807; 5 1.3,2.807 | smd 1.422 x 2.489: 8 -0.963,-0.268; 9 0.963,-0.268 | drill 0.66 pad 0.66: S_1_H1 -2.413,3.2; S_1_H2 -2.413,2.819; S_2_H1 2.413,3.2; S_2_H2 2.413,2.819 | drill 0.711 pad 0.711: S_3_H1 -2.718,0.229; S_3_H2 -2.718,-0.254; S_4_H1 2.718,0.229; S_4_H2 2.718,-0.254
CONN_FH40-24S-0.5SV_HIR = smd 0.356 x 1.194: 1 5.75,2.201; 2 5.25,-0.849; 3 4.75,2.201; 4 4.25,-0.849; 5 3.75,2.201; 6 3.25,-0.849; 7 2.75,2.201; 8 2.25,-0.849; 9 1.75,2.201; 10 1.25,-0.849; 11 0.75,2.201; 12 0.25,-0.849; 13 -0.25,2.201; 14 -0.75,-0.849; 15 -1.25,2.201; 16 -1.75,-0.849; 17 -2.25,2.201; 18 -2.75,-0.849; 19 -3.25,2.201; 20 -3.75,-0.849; 21 -4.25,2.201; 22 -4.75,-0.849; 23 -5.25,2.201; 24 -5.75,-0.849
1X04 = drill 1.016 long: 1 -3.81,0; 2 -1.27,0; 3 1.27,0; 4 3.81,0
NRS8030T6R8MJGJ = smd 1.8 x 7.5: P$1 0,0; P$2 5.6,0
IHLP4040DZER2R0M11 = smd 3.251 x 3.124: P$1 0,0; P$2 8.934,0
CHIP-LED0805 = smd 1.2 x 1.2: A 0,-1.05; C 0,1.05
R0805 = smd 1.3 x 1.5: 1 -0.95,0; 2 0.95,0
RL1632T4F-R005-FNH = smd 1 x 0.8: P$1 0,0; P$2 1.75,0 | smd 1 x 2.32: P$3 0,1.94; P$4 1.75,1.94
BOURNS-3361 = smd 1.19 x 3.3: P$1 0,0; P$2 5.08,0; P$3 2.54,4.4
R0603 = smd 1 x 1.1: 1 -0.85,0; 2 0.85,0
RL0816T4F-4 = smd 0.4 x 1.3: 1 0,0; 2 0.75,0 | smd 0.4 x 0.4: 3 0,1.05; 4 0.75,1.05
PTS636-F = smd 2.4 x 1: P$1 0,0; P$2 6.6,0
C&K-JS202011SCQN-SWITCH = smd 1.2 x 2.5: P$1 0,5.5; P$2 2.5,5.5; P$3 5,5.5; P$4 0,0; P$5 2.5,0; P$6 5,0
C&K-PTS636SL43SMTRLFS-PUSHBUTTON = smd 2 x 1.5: P$1 0,0; P$2 8.2,0
TSOP-6 = smd 0.442 x 0.922: P$1 0,0; P$2 0.95,0; P$3 1.9,0; P$4 0,2.548; P$5 0.95,2.548; P$6 1.9,2.548
SOT323 = smd 0.55 x 0.6: 1 1.85,-0.65; 2 1.85,0.65; 3 0,0
ESP32-WROVER-E = smd 1.5 x 0.9: 1 0,0; 2 0,-1.27; 3 0,-2.54; 4 0,-3.81; 5 0,-5.08; 6 0,-6.35; 7 0,-7.62; 8 0,-8.89; 9 0,-10.16; 10 0,-11.43; 11 0,-12.7; 12 0,-13.97; 13 0,-15.24; 14 0,-16.51; 15 0,-17.78; 16 0,-19.05; 17 0,-20.32; 18 0,-21.59; 19 0,-22.86; 20 17.5,-22.86; 21 17.5,-21.59; 22 17.5,-20.32; 23 17.5,-19.05; 24 17.5,-17.78; 25 17.5,-16.51; 26 17.5,-15.24; 27 17.5,-13.97; 28 17.5,-12.7; 29 17.5,-11.43; 30 17.5,-10.16; 31 17.5,-8.89; 32 17.5,-7.62; 33 17.5,-6.35; 34 17.5,-5.08; 35 17.5,-3.81; 36 17.5,-2.54; 37 17.5,-1.27; 38 17.5,0 | smd 0.9 x 0.9: 39 7.25,-7.8; 40 5.85,-6.4; 41 7.25,-6.4; 42 8.65,-6.4; 43 5.85,-7.8; 44 8.65,-7.8; 45 5.85,-9.2; 46 7.25,-9.2; 47 8.65,-9.2
LTC3129EMSE-1 = smd 0.305 x 0.889: P$1 0,0; P$2 0.5,0; P$3 1,0; P$4 1.5,0; P$5 2,0; P$6 2.5,0; P$7 3,0; P$8 3.5,0; P$9 3.5,4.209; P$10 3,4.209; P$11 2.5,4.209; P$12 2,4.209; P$13 1.5,4.209; P$14 1,4.209; P$15 0.5,4.209; P$16 0,4.209 | smd 2.845 x 1.651: P$17 1.75,2.104
TPS5432DDAR = smd 0.5 x 2.2: P$1 0,0; P$2 1.27,0; P$3 2.54,0; P$4 3.81,0; P$5 0,5.75; P$6 1.27,5.75; P$7 2.54,5.75; P$8 3.81,5.75 | smd 3.1 x 2.4: P$9 1.905,2.875
21-0041_S8+2_MXM = smd 1.46 x 0.533: 1 -2.724,1.905; 2 -2.724,0.635; 3 -2.724,-0.635; 4 -2.724,-1.905; 5 2.724,-1.905; 6 2.724,-0.635; 7 2.724,0.635; 8 2.724,1.905
SOIC28-W_MC_MCH = smd 1.97 x 0.558: 1 -4.515,8.255; 2 -4.515,6.985; 3 -4.515,5.715; 4 -4.515,4.445; 5 -4.515,3.175; 6 -4.515,1.905; 7 -4.515,0.635; 8 -4.515,-0.635; 9 -4.515,-1.905; 10 -4.515,-3.175; 11 -4.515,-4.445; 12 -4.515,-5.715; 13 -4.515,-6.985; 14 -4.515,-8.255; 15 4.515,-8.255; 16 4.515,-6.985; 17 4.515,-5.715; 18 4.515,-4.445; 19 4.515,-3.175; 20 4.515,-1.905; 21 4.515,-0.635; 22 4.515,0.635; 23 4.515,1.905; 24 4.515,3.175; 25 4.515,4.445; 26 4.515,5.715; 27 4.515,6.985; 28 4.515,8.255
DBV0006A_N = smd 1 x 0.6: 1 -1.375,0.95; 2 -1.375,0; 3 -1.375,-0.95; 4 1.375,-0.95; 5 1.375,0; 6 1.375,0.95
TSSOP14_PW_TEX = smd 1.41 x 0.356: 1 -2.953,1.95; 2 -2.953,1.3; 3 -2.953,0.65; 4 -2.953,0; 5 -2.953,-0.65; 6 -2.953,-1.3; 7 -2.953,-1.95; 8 2.953,-1.95; 9 2.953,-1.3; 10 2.953,-0.65; 11 2.953,0; 12 2.953,0.65; 13 2.953,1.3; 14 2.953,1.95
PW_16_TEX = smd 1.4 x 0.35: 1 -2.95,2.275; 2 -2.95,1.625; 3 -2.95,0.975; 4 -2.95,0.325; 5 -2.95,-0.325; 6 -2.95,-0.975; 7 -2.95,-1.625; 8 -2.95,-2.275; 9 2.95,-2.275; 10 2.95,-1.625; 11 2.95,-0.975; 12 2.95,-0.325; 13 2.95,0.325; 14 2.95,0.975; 15 2.95,1.625; 16 2.95,2.275
SOIC8_SA_SST_MCH = smd 1.46 x 0.559: 1 -2.724,1.905; 2 -2.724,0.635; 3 -2.724,-0.635; 4 -2.724,-1.905; 5 2.724,-1.905; 6 2.724,-0.635; 7 2.724,0.635; 8 2.724,1.905
DBV0005A_N = smd 1 x 0.6: 1 -1.375,0.95; 2 -1.375,0; 3 -1.375,-0.95; 4 1.375,-0.95; 5 1.375,0.95
DBV0005A-IPC_A = smd 1.805 x 0.612: 1 -1.15,0.95; 2 -1.15,0; 3 -1.15,-0.95; 4 1.15,-0.95; 5 1.15,0.95
TJ5A = smd 0.94 x 1.778: 1 -3.404,-8.763; 2 -1.702,-8.763; 3 0,-8.763; 4 1.702,-8.763; 5 3.404,-8.763 | smd 5.588 x 6.655: 6 0,0.94
B2B-XH-A(LF)(SN) = drill 1 square: GND -2.5,0; VIN 0,0
MS23BNW03 = drill 1.8 square: P$1 0,0; P$2 0,-4.7; P$3 0,-9.4; P$4 4.8,0; P$5 4.8,-4.7; P$6 4.8,-9.4
V_TEST = drill 1 square: 1 0,0

### Placement (x,y rotation side)
A1  not placed on the board
A2  not placed on the board
A3  not placed on the board
A4  not placed on the board
C1  not placed on the board
C2  not placed on the board
C3  103.05,43.18 0 top
C4  not placed on the board
C5  not placed on the board
C6  not placed on the board
C7  not placed on the board
C8  not placed on the board
C9  not placed on the board
C10  not placed on the board
C11  not placed on the board
C12  not placed on the board
C13  not placed on the board
C14  not placed on the board
C15  not placed on the board
C16  not placed on the board
C17  not placed on the board
C18  not placed on the board
C19  not placed on the board
C20  not placed on the board
C21  not placed on the board
C22  not placed on the board
C23  not placed on the board
C24  not placed on the board
C25  not placed on the board
C26  not placed on the board
C27  not placed on the board
C28  not placed on the board
C29  not placed on the board
C30  not placed on the board
C31  not placed on the board
C32  not placed on the board
C33  not placed on the board
C34  not placed on the board
C35  not placed on the board
C36  not placed on the board
C37  not placed on the board
C38  not placed on the board
C39  not placed on the board
C40  not placed on the board
C41  not placed on the board
C42  not placed on the board
C43  not placed on the board
C44  not placed on the board
C45  not placed on the board
C46  not placed on the board
C47  not placed on the board
C48  not placed on the board
C49  not placed on the board
C50  not placed on the board
D1  not placed on the board
D2  not placed on the board
D3  not placed on the board
D4  not placed on the board
J1  2.72,58.42 0 top
J2  202.11,68.58 270 top
J3  59.87,82.55 0 top
JP1  not placed on the board
L1  90.35,39.37 0 top
L2  109.4,41.91 0 top
L3  78.92,39.37 0 top
LED1  not placed on the board
R1  not placed on the board
R2  not placed on the board
R3  not placed on the board
R4  not placed on the board
R5  14.15,69.85 0 top
R6  not placed on the board
R7  not placed on the board
R8  not placed on the board
R9  not placed on the board
R10  49.71,36.83 0 top
R11  not placed on the board
R12  not placed on the board
R13  not placed on the board
R14  not placed on the board
R15  not placed on the board
R16  39.55,36.83 0 top
R17  not placed on the board
R18  not placed on the board
R19  not placed on the board
R20  29.39,36.83 0 top
R21  not placed on the board
R22  not placed on the board
R23  not placed on the board
R24  not placed on the board
R25  not placed on the board
R26  6.53,69.85 0 top
R27  not placed on the board
R28  not placed on the board
R29  not placed on the board
R30  not placed on the board
R31  118.29,82.55 0 top
R32  not placed on the board
R33  not placed on the board
R34  not placed on the board
R35  not placed on the board
R36  not placed on the board
R37  not placed on the board
R38  not placed on the board
R39  not placed on the board
R40  not placed on the board
R41  not placed on the board
R42  not placed on the board
R43  not placed on the board
R44  not placed on the board
S1  86.54,58.42 0 top
S2  17.96,55.88 0 top
S3  62.41,69.85 0 top
S4  72.57,58.42 0 top
S5  58.6,58.42 0 top
S6  44.63,58.42 0 top
TR1  1.45,81.28 0 top
TR2  not placed on the board
TR3  44.63,71.12 0 top
TR4  23.04,71.12 0 top
U1  213.54,77.47 0 top
U2  103.05,69.85 0 top
U3  59.87,36.83 0 top
U4  52.25,16.51 0 top
U5  221.16,43.18 90 top
U6  not placed on the board
U7  226.24,31.75 0 top
U8  183.06,7.62 0 top
U9  95.43,83.82 0 top
U10  not placed on the board
U11  not placed on the board
U$1  101.78,20.32 0 top
X1  9.07,39.37 0 top
X2  103.05,58.42 0 top
X3  0.18,15.24 0 top
X5  not placed on the board
X6  not placed on the board
X7  not placed on the board
X8  not placed on the board
X9  not placed on the board
X10  not placed on the board

### Tracks (layer width: path | path; a pad name or v marks a point on that pad's centre or on a via)
BAT_CURR_VAL  (1 unrouted)
BAT_VOLT_VAL  (3 unrouted)
CAM_D0  (1 unrouted)
CAM_D1  (1 unrouted)
CAM_D2  (1 unrouted)
CAM_D3  (1 unrouted)
CAM_D4
  Top 0.254: U1.4 213,73.12 212.67,73.12 210.88,71.33 J2.18
CAM_D5
  Top 0.254: U1.5 213,71.85 212.67,71.85 211.15,70.33 J2.16
CAM_D6
  Top 0.254: U1.6 211.75,69.33 J2.14
CAM_D7
  Top 0.254: U1.7 212.02,68.33 J2.12
CAM_HSYNC  (1 unrouted)
CAM_PCLK  (2 unrouted)
CAM_SIOC  (2 unrouted)
CAM_SIOD  (2 unrouted)
CAM_VSYNC  (1 unrouted)
CAM_XCLK  (1 unrouted)
CS1  (1 unrouted)
CS2  (1 unrouted)
CS3  (1 unrouted)
FLASH_WP  (1 unrouted)
GND  (114 unrouted)
GPIO_INTA  (1 unrouted)
IO0  (2 unrouted)
IO2  (1 unrouted)
LCD_BUSY  (1 unrouted)
MUX_A0  (1 unrouted)
MUX_A1  (1 unrouted)
MUX_A2  (1 unrouted)
N$1  (1 unrouted)
N$2  (4 unrouted)
N$3  (8 unrouted)
N$4  (1 unrouted)
N$5  (1 unrouted)
N$6  (4 unrouted)
N$7  (2 unrouted)
N$8  (3 unrouted)
N$9  (2 unrouted)
N$10  (2 unrouted)
N$11  (1 unrouted)
N$12  (2 unrouted)
N$13  (1 unrouted)
N$14  (4 unrouted)
N$15  (1 unrouted)
N$16  (2 unrouted)
N$17  (1 unrouted)
N$18  (4 unrouted)
N$19  (2 unrouted)
N$20  (1 unrouted)
N$21  (1 unrouted)
N$22  (2 unrouted)
N$23  (1 unrouted)
N$24  (8 unrouted)
N$25  (1 unrouted)
N$26  (1 unrouted)
N$27  (1 unrouted)
N$28  (3 unrouted)
N$29  (1 unrouted)
N$30  (3 unrouted)
N$31  (2 unrouted)
N$32  (1 unrouted)
N$33  (1 unrouted)
N$34  (1 unrouted)
N$35  (5 unrouted)
N$36  (1 unrouted)
N$37  (1 unrouted)
N$38  (1 unrouted)
N$39  (1 unrouted)
N$40  (1 unrouted)
N$41  (1 unrouted)
N$42  (1 unrouted)
N$43  (1 unrouted)
N$44  (1 unrouted)
N$45  (1 unrouted)
N$46  (2 unrouted)
N$47  (1 unrouted)
N$48  (1 unrouted)
N$49  (2 unrouted)
N$50  (1 unrouted)
N$51  (2 unrouted)
N$52  (4 unrouted)
N$53  (1 unrouted)
N$54  (2 unrouted)
N$55  (2 unrouted)
N$56  (2 unrouted)
N$57  (2 unrouted)
N$65  (6 unrouted)
P_RESET  (2 unrouted)
RESET  (3 unrouted)
SOLAR_CURR_VAL  (1 unrouted)
SOLAR_VOLT_VAL  (2 unrouted)
SPI_CLK  (4 unrouted)
SPI_CS0  (4 unrouted)
SPI_CS1  (1 unrouted)
SPI_CS2  (1 unrouted)
SPI_CS3  (1 unrouted)
SPI_MISO  (4 unrouted)
SPI_MOSI  (3 unrouted)
TOT_CURR_VAL  (1 unrouted)
TOT_VOLT_VAL  (2 unrouted)
UART_RX  (1 unrouted)
UART_TX  (1 unrouted)
UX_SW1  (3 unrouted)
UX_SW2  (3 unrouted)
UX_SW3  (3 unrouted)
UX_SW4  (3 unrouted)
V_BAT_CHARGE  (2 unrouted)
V_BAT_IN  (3 unrouted)
V_BAT_OUT  (4 unrouted)
V_COMBO  (3 unrouted)
V_SOLAR_IN  (3 unrouted)
V_SOLAR_OUT  (4 unrouted)
VCC  (38 unrouted)